# EAGLE design Tilt-A-Whirl_RPI-1031 (EAGLE 6.4)
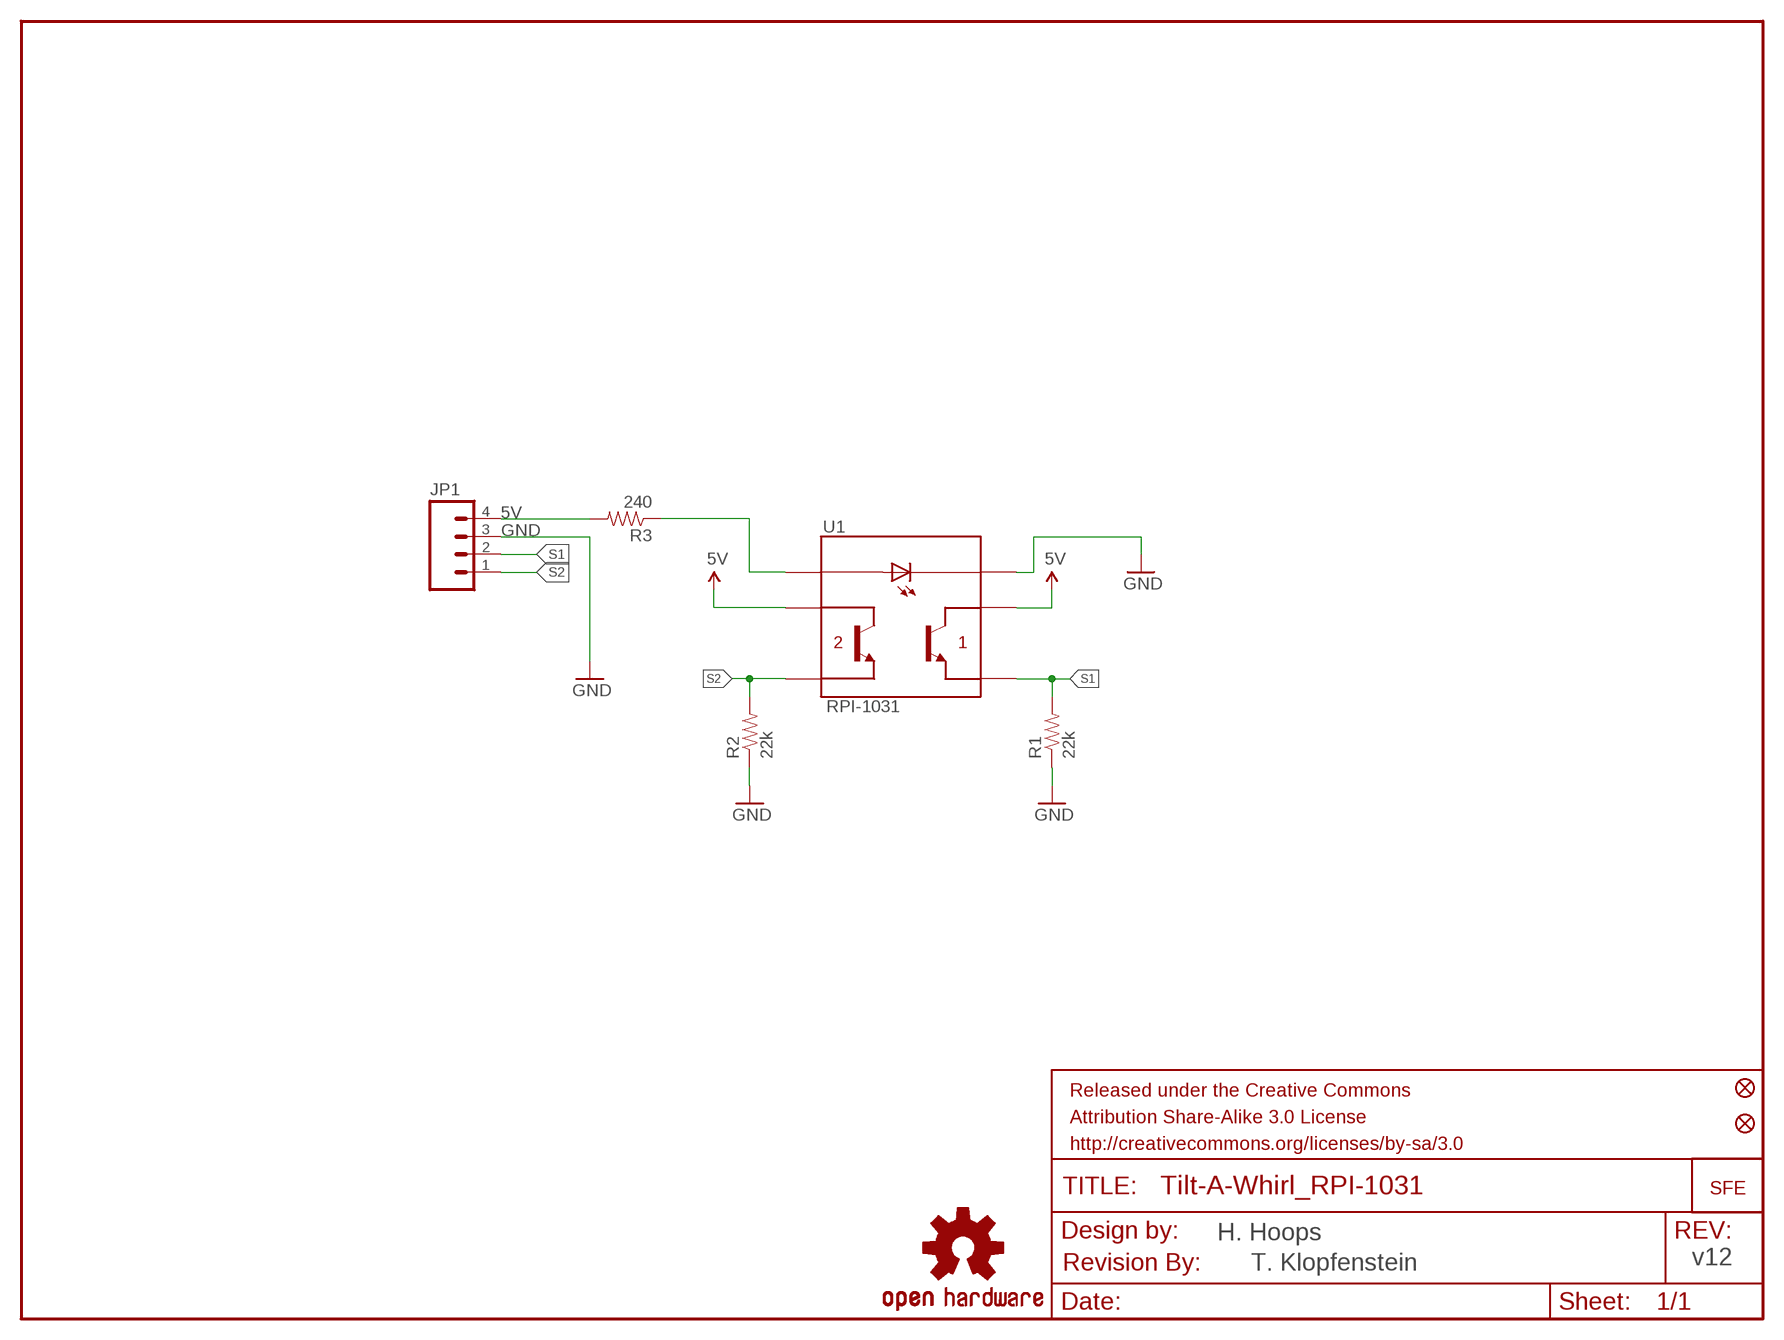
[diagram p0: schematic, sheet 1]

## Parts
FRAME1  FRAME-LETTER  [CREATIVE_COMMONS]
JP1  M04PTH  [1X04]
JP2  FIDUCIAL1X2.5  [FIDUCIAL-1X2.5]
JP3  FIDUCIAL1X2.5  [FIDUCIAL-1X2.5]
JP4  LOGO-SFESK  [SFE-LOGO-FLAME]
R1  22k  22KOHM1/10W1%(0603)  [0603-RES]
R2  22k  22KOHM1/10W1%(0603)  [0603-RES]
R3  240  240OHM1/10W1%(0603)  [0603-RES]
U1  RPI-1031  [RPI-1031]
U$1  OSHW-LOGOS  [OSHW-LOGO-S]
U$2  REVISION  [REVISION]

## Nets
5V: JP1.4 R3.2 U1.2(C1) U1.5(C2)
AN: R3.1 U1.6(ANODE)
GND: JP1.3 R1.1 R2.1 U1.3(CATHODE)
S1: JP1.2 R1.2 U1.1(E1)
S2: JP1.1 R2.2 U1.4(E2)

## Notes on the sheet
- H. Hoops
- T. Klopfenstein | v12

## Library data of the parts
FRAME1 = SparkFun-Aesthetics:FRAME-LETTER: Schematic Frame Standard 8.5x11 US Letter frame
JP1 = SparkFun:M04: Header 4 Standard 4-pin 0.1" header. Use with straight break away headers (SKU : PRT-00116), right angle break away headers (PRT-00553), swiss pins (PRT-00743), machine pins (PRT-00117), and female headers (PRT-00115). Molex polarized connector foot print use with SKU : PRT-08231 with associated crimp pins and housings.
JP2 JP3 = abes:FIDUCIAL: Fiducial Alignment Points Various fiducial points for machine vision alignment.
JP4 = SparkFun:LOGO-SFE: Spark Fun Electronics PCB Logo This is the standard Spark Fun Electronics PCB logo.
R1 R2 = SparkFun-Resistors:22KOHM1/10W1%(0603): RES-07853; PROD_ID: RES-07853; VALUE: 22K
R3 = SparkFun-Resistors:240OHM1/10W1%(0603): RES-07849; PROD_ID: RES-07849
U1 = Local Lirary:RPI-1031
U$1 = SparkFun:OSHW-LOGO: Open Source Hardware Logo This logo indicates the piece of hardware it is found on incorporates a OSHW license and/or adheres to the definition of open source hardware found here: http://freedomdefined.org/OSHW
U$2 = SparkFun-Aesthetics:REVISION

## Board
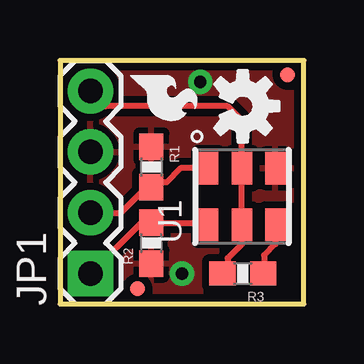
[diagram p1: board, top side]
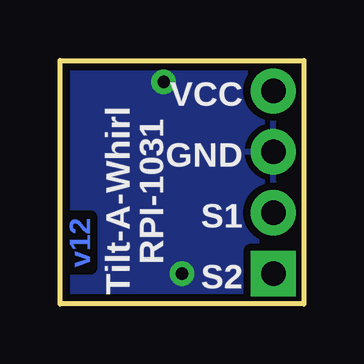
[diagram p2: board, bottom side, seen from below]

Size 10.16 x 10.16 mm. Coordinates in mm from the lower left corner, seen from the top.
Outline: 0,0 10.16,0 10.16,10.16 0,10.16 0,0
Copper layers (1*16): Top 0.035mm / dielectric 1.5mm / Bottom 0.035mm
Design rules "SparkFun *": minimum track width 8mil, minimum drill 20mil, track to track 8mil, track to pad 8mil, pad to pad 8mil, via to via 8mil, smd to smd 8mil, copper to edge 8mil, drill to drill 8mil, minimum pad ring 12mil, minimum via ring 10mil, stop-mask expansion 4mil, vias tented up to drill 20mil, thermal gap 10mil

### Footprints (pad centres in the part's own frame; a part is rotated, then mirrored left to right if it is on the bottom)
1X04 = drill 1.016 pad 1.88 square: 1 0,0 | drill 1.016 pad 1.88: 2 2.54,0; 3 5.08,0; 4 7.62,0
FIDUCIAL-1X2.5 = smd 0.635 x 0.635: 1 0,0
0603-RES = smd 1.1 x 1: 1 -0.85,0; 2 0.85,0
RPI-1031 = smd 1.35 x 0.85: 1 1.22,1.445; 2 1.22,0.045; 3 1.22,-1.355; 4 -1.13,1.445; 5 -1.13,0.045; 6 -1.13,-1.355

### Placement (x,y rotation side)
FRAME1  -24.87,-11.43 0 top  (outside the outline)
JP1  1.27,1.27 90 top
JP2  9.47,9.55 0 top
JP3  3.23,0.64 0 top
JP4  2.92,9.53 270 top
R1  3.81,5.71 270 top
R2  3.81,2.54 90 top
R3  7.62,1.27 180 top
U1  7.62,4.45 90 top
U$1  7.62,8.26 270 top
U$2  -13.97,-13.97 0 top  (outside the outline)

### Tracks (layer width: path | path; a pad name or v marks a point on that pad's centre or on a via)
5V
  Top 0.254: JP1.4 1.91,8.26 6.99,8.26 7.58,7.67 U1.2 U1.5 7.58,2.5 6.99,1.91 6.99,1.49 R3.2
AN
  Top 0.254: U1.6 8.97,2.5 8.51,2.03 8.51,1.31 R3.1
GND  (via drill 0.51)
  other vias: 5.84,9.27 5.08,1.27
  pour Top (isolate 0.305): 0,0 0,10.16 10.16,10.16 10.16,0
  pour Bottom (isolate 0.305): 10.16,0 0,0 0,10.16 10.16,10.16
S1
  Top 0.254: JP1.2 2.54,3.81 3.6,4.87 R1.2 4.03,5.08 4.45,5.08 5.03,5.67 U1.1
S2
  Top 0.254: JP1.1 3.39,3.39 R2.2 6.1,3.39 U1.4

### Text on the board
Bottom: v12
bPlace: VCC | GND | S1 | S2 | RPI-1031 | Tilt-A-Whirl
tNames: H. Hoops | T. Klopfenstein